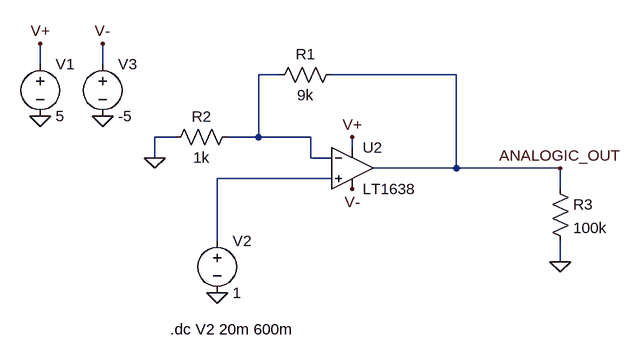
[diagram p0: schematic Conversor senyal temperatura.asc]
Conversor senyal temperatura.asc, the LTspice schematic file:
Version 4
SHEET 1 880 680
WIRE -240 32 -240 0
WIRE -144 32 -144 0
WIRE 128 48 96 48
WIRE 400 48 208 48
WIRE -32 144 -64 144
WIRE 96 144 96 48
WIRE 96 144 48 144
WIRE 176 144 96 144
WIRE 240 160 240 144
WIRE -64 176 -64 144
WIRE 176 176 176 144
WIRE 208 176 176 176
WIRE 400 192 400 48
WIRE 400 192 272 192
WIRE 560 192 400 192
WIRE 208 208 32 208
WIRE 560 224 560 192
WIRE 32 304 32 208
WIRE 560 336 560 304
FLAG 32 384 0
FLAG -240 112 0
FLAG 240 144 V+
FLAG -240 0 V+
FLAG 560 192 ANALOGIC_OUT
FLAG -64 176 0
FLAG -144 112 0
FLAG -144 0 V-
FLAG 240 224 V-
FLAG 560 336 0
SYMBOL res 224 32 R90
WINDOW 0 0 56 VBottom 2
WINDOW 3 32 56 VTop 2
SYMATTR InstName R1
SYMATTR Value 9k
SYMBOL res 64 128 R90
WINDOW 0 0 56 VBottom 2
WINDOW 3 32 56 VTop 2
SYMATTR InstName R2
SYMATTR Value 1k
SYMBOL voltage -240 16 R0
WINDOW 123 0 0 Left 0
WINDOW 39 0 0 Left 0
SYMATTR InstName V1
SYMATTR Value 5
SYMBOL voltage 32 288 R0
WINDOW 123 0 0 Left 0
WINDOW 39 0 0 Left 0
SYMATTR InstName V2
SYMATTR Value 1
SYMBOL voltage -144 16 R0
WINDOW 123 0 0 Left 0
WINDOW 39 0 0 Left 0
SYMATTR InstName V3
SYMATTR Value -5
SYMBOL res 544 208 R0
SYMATTR InstName R3
SYMATTR Value 100k
SYMBOL OpAmps\\LT1638 240 128 R0
SYMATTR InstName U2
TEXT -40 440 Left 2 !.dc V2 20m 600m

The netlist it stands for:
* Conversor senyal temperatura.asc
R1 ANALOGIC_OUT N001 9k
R2 N001 0 1k
V1 V+ 0 5
V2 N002 0 1
V3 V- 0 -5
R3 ANALOGIC_OUT 0 100k
XU2 N002 N001 V+ V- ANALOGIC_OUT LT1638  ; pins In+ In- V+ V- OUT
.dc V2 20m 600m
.backanno
.end